# Altium schematic sheet my_bcd_clock.SchDoc
size A3
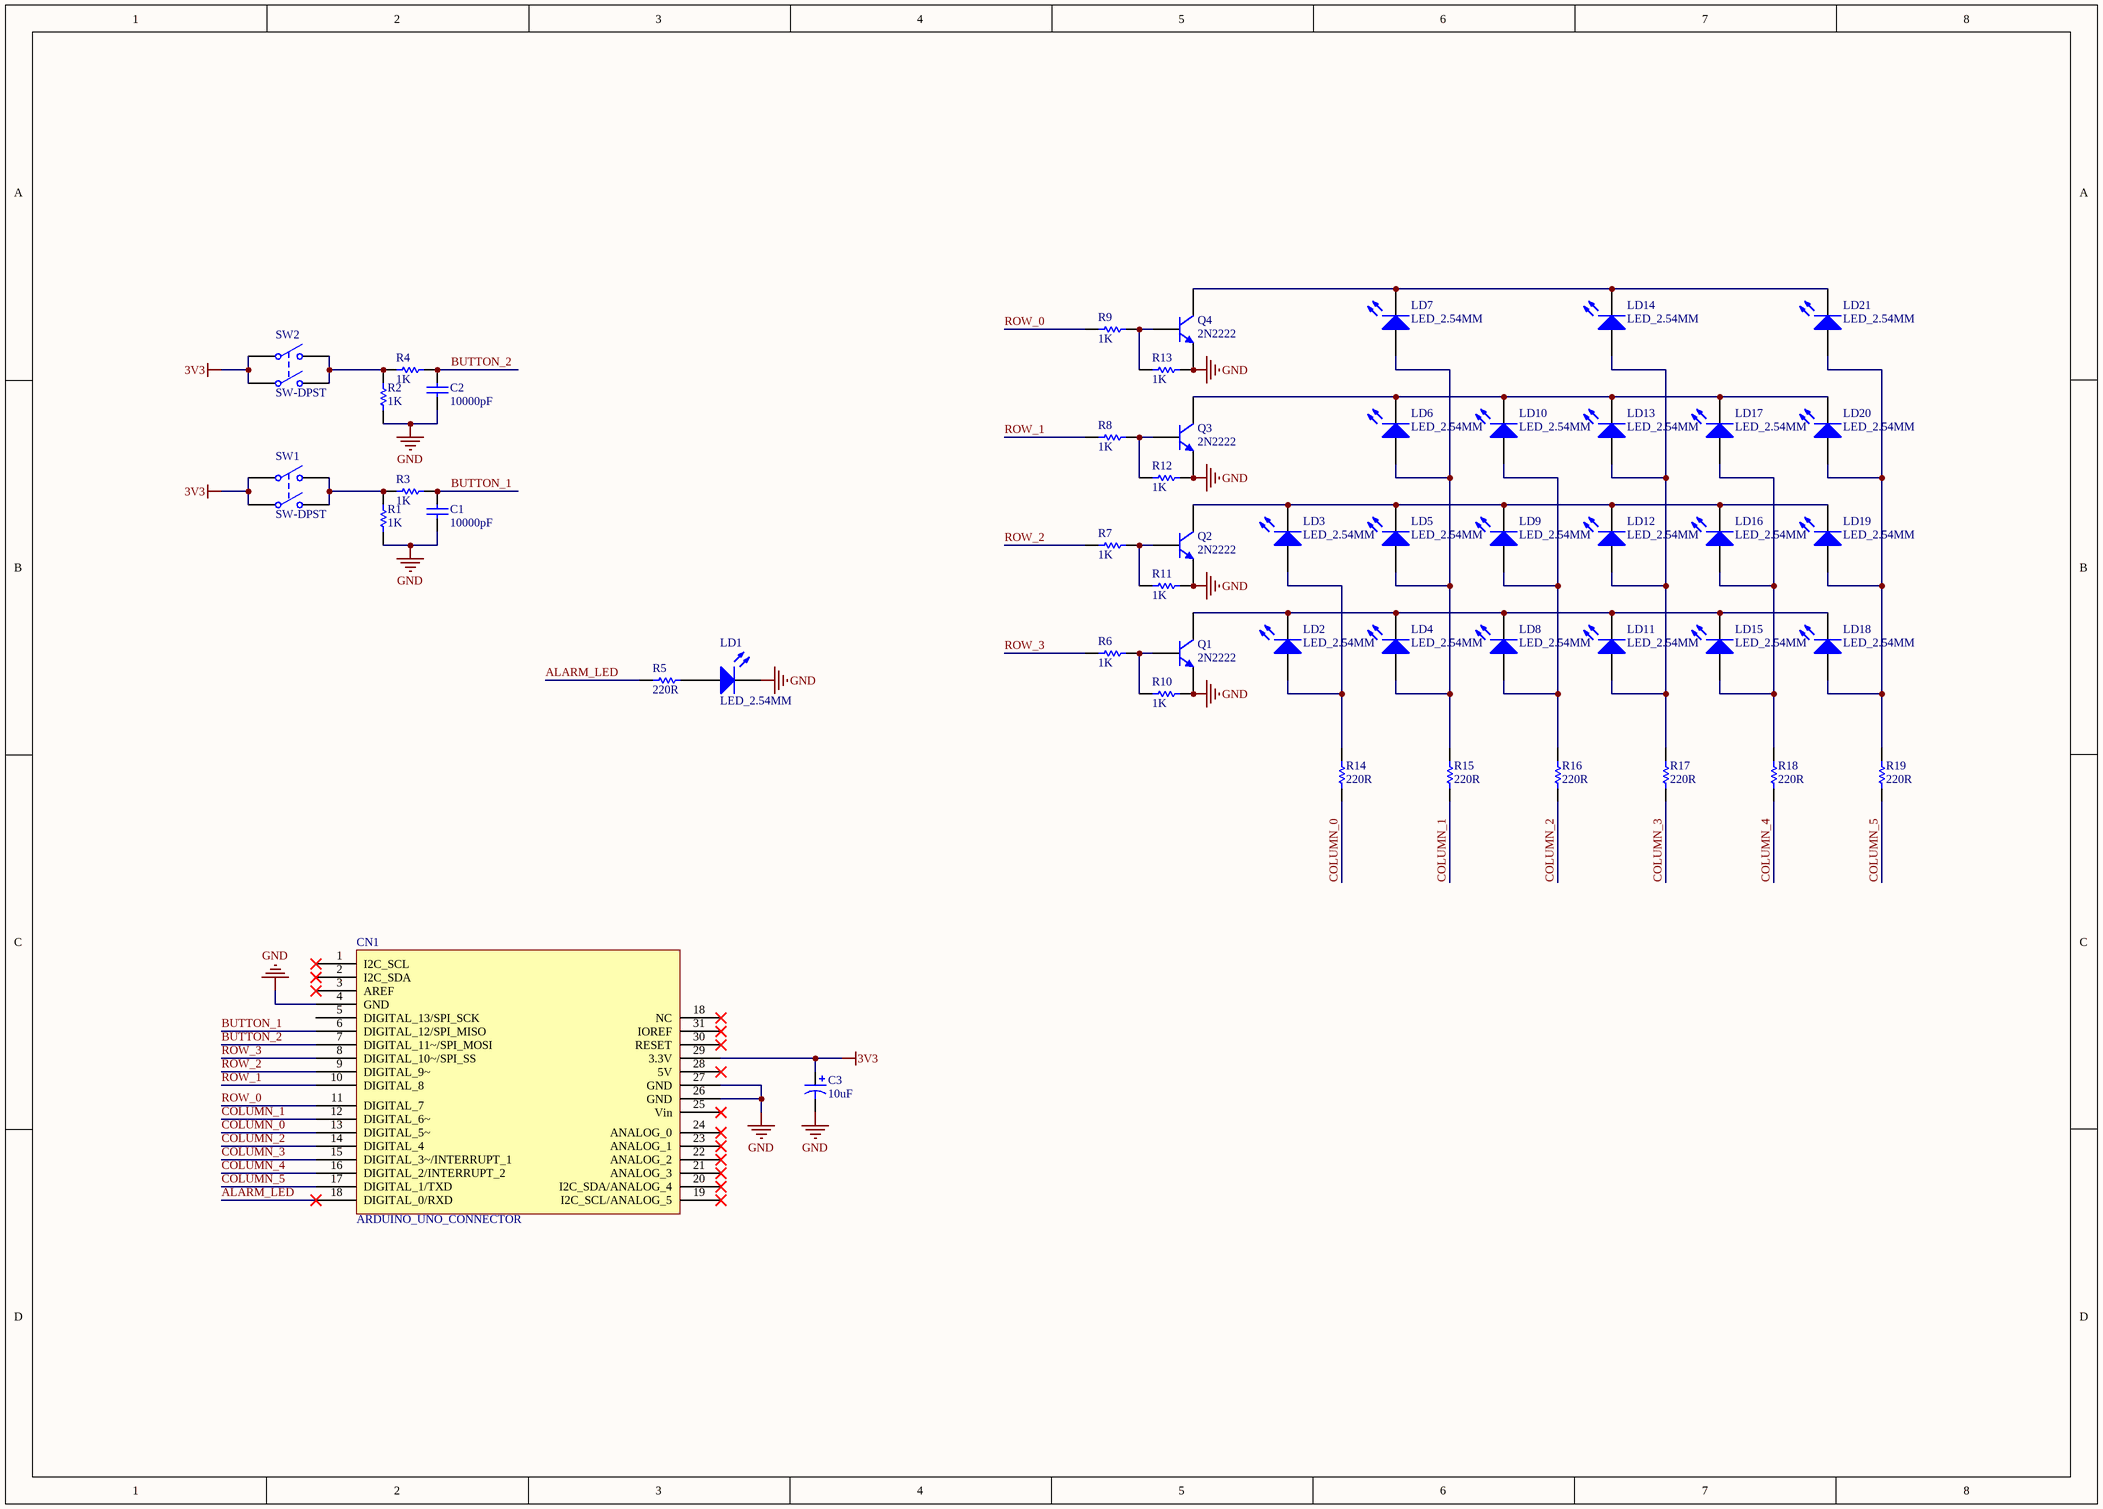
[diagram p0: my_bcd_clock.SchDoc]

## Parts
C1  10000pF  [RAD-0.3]
C2  10000pF  [RAD-0.3]
C3  10uF  [RADIAL_CAN_5MM]
CN1  ARDUINO_UNO_CONNECTOR  [ARDUINO_UNO_CONNECTOR]
LD1  LED_2.54MM  [LED_2.54MM]
LD2  LED_2.54MM  [LED_2.54MM]
LD3  LED_2.54MM  [LED_2.54MM]
LD4  LED_2.54MM  [LED_2.54MM]
LD5  LED_2.54MM  [LED_2.54MM]
LD6  LED_2.54MM  [LED_2.54MM]
LD7  LED_2.54MM  [LED_2.54MM]
LD8  LED_2.54MM  [LED_2.54MM]
LD9  LED_2.54MM  [LED_2.54MM]
LD10  LED_2.54MM  [LED_2.54MM]
LD11  LED_2.54MM  [LED_2.54MM]
LD12  LED_2.54MM  [LED_2.54MM]
LD13  LED_2.54MM  [LED_2.54MM]
LD14  LED_2.54MM  [LED_2.54MM]
LD15  LED_2.54MM  [LED_2.54MM]
LD16  LED_2.54MM  [LED_2.54MM]
LD17  LED_2.54MM  [LED_2.54MM]
LD18  LED_2.54MM  [LED_2.54MM]
LD19  LED_2.54MM  [LED_2.54MM]
LD20  LED_2.54MM  [LED_2.54MM]
LD21  LED_2.54MM  [LED_2.54MM]
Q1  2N2222  [TO-226-AA]
Q2  2N2222  [TO-226-AA]
Q3  2N2222  [TO-226-AA]
Q4  2N2222  [TO-226-AA]
R1  1K  [AXIAL-0.3]
R2  1K  [AXIAL-0.3]
R3  1K  [AXIAL-0.3]
R4  1K  [AXIAL-0.3]
R5  220R  [AXIAL-0.3]
R6  1K  [AXIAL-0.3]
R7  1K  [AXIAL-0.3]
R8  1K  [AXIAL-0.3]
R9  1K  [AXIAL-0.3]
R10  1K  [AXIAL-0.3]
R11  1K  [AXIAL-0.3]
R12  1K  [AXIAL-0.3]
R13  1K  [AXIAL-0.3]
R14  220R  [AXIAL-0.3]
R15  220R  [AXIAL-0.3]
R16  220R  [AXIAL-0.3]
R17  220R  [AXIAL-0.3]
R18  220R  [AXIAL-0.3]
R19  220R  [AXIAL-0.3]
SW1  SW-DPST  [DPST-4]
SW2  SW-DPST  [DPST-4]

## Nets
3V3: C3.1 CN1.29(3.3V) SW1.1(COMMON1) SW1.3(COMMON2) SW2.1(COMMON1) SW2.3(COMMON2)
GND: C1.2 C2.2 C3.2 CN1.4(GND) CN1.26(GND) CN1.27(GND) LD1.2(K) Q1.3(E) Q2.3(E) Q3.3(E) Q4.3(E) R1.1 R2.1 R10.1 R11.1 R12.1 R13.2
ALARM_LED: CN1.18(NC) R5.2
BUTTON_1: C1.1 CN1.6(DIGITAL_12/SPI_MISO) R3.2
BUTTON_2: C2.1 CN1.7(DIGITAL_11~/SPI_MOSI) R4.2
COLUMN_0: CN1.13(DIGITAL_5~) R14.1
COLUMN_1: CN1.12(DIGITAL_6~) R15.1
COLUMN_2: CN1.14(DIGITAL_4) R16.1
COLUMN_3: CN1.15(DIGITAL_3~/INTERRUPT_1) R17.1
COLUMN_4: CN1.16(DIGITAL_2/INTERRUPT_2) R18.1
COLUMN_5: CN1.17(DIGITAL_1/TXD) R19.1
ROW_0: CN1.11(DIGITAL_7) R9.1
ROW_1: CN1.10(DIGITAL_8) R8.1
ROW_2: CN1.9(DIGITAL_9~) R7.1
ROW_3: CN1.8(DIGITAL_10~/SPI_SS) R6.2
NetLD1_1: LD1.1(A) R5.1
NetLD2_1: LD2.1(A) LD3.1(A) R14.2
NetLD2_2: LD2.2(K) LD4.2(K) LD8.2(K) LD11.2(K) LD15.2(K) LD18.2(K) Q1.1(C)
NetLD3_2: LD3.2(K) LD5.2(K) LD9.2(K) LD12.2(K) LD16.2(K) LD19.2(K) Q2.1(C)
NetLD4_1: LD4.1(A) LD5.1(A) LD6.1(A) LD7.1(A) R15.2
NetLD6_2: LD6.2(K) LD10.2(K) LD13.2(K) LD17.2(K) LD20.2(K) Q3.1(C)
NetLD7_2: LD7.2(K) LD14.2(K) LD21.2(K) Q4.1(C)
NetLD8_1: LD8.1(A) LD9.1(A) LD10.1(A) R16.2
NetLD11_1: LD11.1(A) LD12.1(A) LD13.1(A) LD14.1(A) R17.2
NetLD15_1: LD15.1(A) LD16.1(A) LD17.1(A) R18.2
NetLD18_1: LD18.1(A) LD19.1(A) LD20.1(A) LD21.1(A) R19.2
NetQ1_2: Q1.2(B) R6.1 R10.2
NetQ2_2: Q2.2(B) R7.2 R11.2
NetQ3_2: Q3.2(B) R8.2 R12.2
NetQ4_2: Q4.2(B) R9.2 R13.1
NetR1_2: R1.2 R3.1 SW1.2(NO1) SW1.4(NO2)
NetR2_2: R2.2 R4.1 SW2.2(NO1) SW2.4(NO2)

Not connected (* = marked no-connect by the designer): CN1 1(I2C_SCL)* 2(I2C_SDA)* 3(AREF)* 5(DIGITAL_13/SPI_SCK) 19(I2C_SCL/ANALOG_5)* 20(I2C_SDA/ANALOG_4)* 21(ANALOG_3)* 22(ANALOG_2)* 23(ANALOG_1)* 24(ANALOG_0)* 25(Vin)* 28(5V)* 30(RESET)* 31(IOREF)*

## Library data of the parts
C1 C2 = Cap: Capacitor
C3 = Cap Pol1: Capacitor
CN1 = ARDUINO_UNO_CONNECTOR: Connector
LD1-LD21 = LED0: LED
Q1-Q4 = NPN
R1-R19 = Res1: Resistor
SW1 SW2 = SW-DPST: Switch